# EAGLE schematic PCB_lite_v6 (EAGLE 9.7.0)
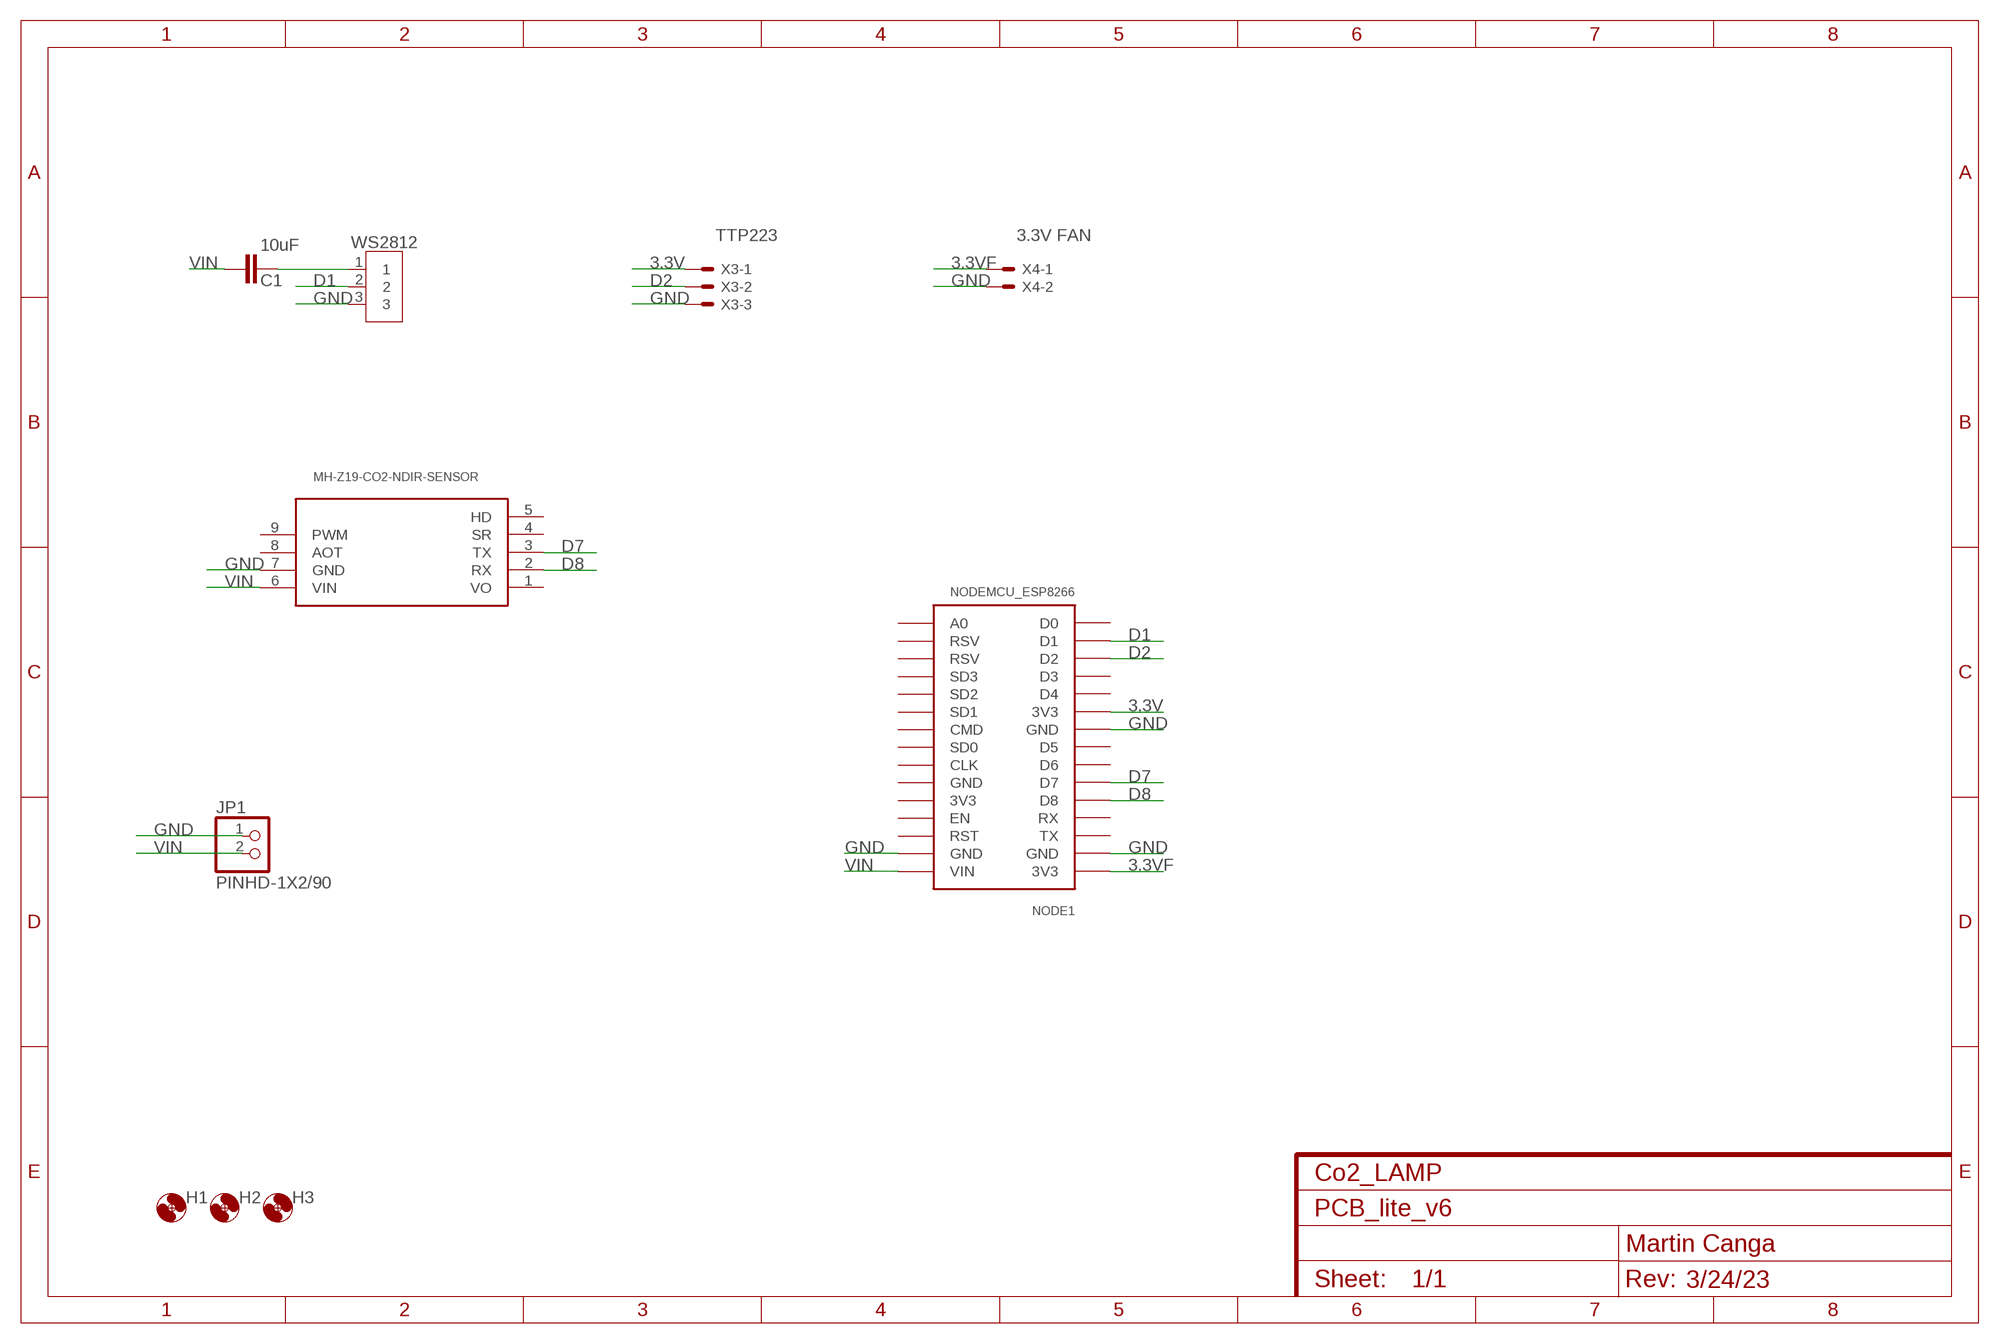
[diagram p0: schematic, sheet 1]
FRAME1 (FRAME-A4L): CNAME: Co2_LAMP; CREVISION: 3/24/23; DESIGNER: Martin Canga

## Parts
C1  10uF  C_CHIP-1210(3225-METRIC)  [CAPC3225X135]
H1  MOUNT-HOLE3.0  [3,0]
H2  MOUNT-HOLE3.0  [3,0]
H3  MOUNT-HOLE3.0  [3,0]
J1  MH-Z19-CO2-NDIR-SENSOR  [MH-Z19]
JP1  PINHD-1X2/90  [1X02/90]
NODE1  NODEMCU_ESP8266  [NODEMCU_ESP8266]
WS2812  2828XX-3282837-3  [TERMBLK_508-3N]
X3  TTP223  JST-XH-03-PIN-ROUND-PAD  [JST-XH-03-PACKAGE-ROUND-PAD]
X4  3.3V FAN  JST-XH-02-PIN-ROUND-PAD  [JST-XH-02-PACKAGE-ROUND-PAD]

## Nets
3.3V: NODE1.3V3@2(3V3) X3.1
3.3VF: NODE1.3V3@1(3V3) X4.1
D1: NODE1.D1 WS2812.2
D2: NODE1.D2 X3.2
D7: J1.3(TX) NODE1.D7
D8: J1.2(RX) NODE1.D8
GND: J1.7(GND) JP1.1 NODE1.GND@1(GND) NODE1.GND@2(GND) NODE1.GND@4(GND) WS2812.3 X3.3 X4.2
N$7: C1.2 WS2812.1
VIN: C1.1 J1.6(VIN) JP1.2 NODE1.VIN
Unconnected: J1.4(SR) J1.5(HD) J1.8(AOT) J1.9(PWM) NODE1.A0 NODE1.CLK NODE1.CMD NODE1.D0 NODE1.D3 NODE1.D4 NODE1.D5 NODE1.D6 NODE1.EN NODE1.RST NODE1.RSV1(RSV) NODE1.RSV2(RSV) NODE1.RX NODE1.SD1 NODE1.SD2 NODE1.SD3 NODE1.SDO(SD0) NODE1.TX

## Power pins joined to a net without a drawn wire
3V3: NODE1.3V3@3(3V3)
GND: NODE1.GND@3(GND)
VO: J1.1(VO)

## Library data of the parts
C1 = Capacitor:C: Capacitor - Generic; CATEGORY: Capacitor
H1-H3 = holes:MOUNT-HOLE: MOUNTING HOLE with drill center marker
J1 = mh-z19:MH-Z19: MH-Z19 - CO2 NDIR SENSOR
JP1 = Connector:PINHD-1X2: PIN HEADER; CATEGORY: CONNECTOR; SUB-CATEGORY: PIN-HEADER
NODE1 = nodemcu_esp8266 (no holes):NODEMCU_ESP8266: Node MCU V2 (ESP8266) Created by Harish
WS2812 = Connector:2828XX-3: 3 Position Wire to Board Terminal Block Horizontal with Board Datasheet <https://www.te.com.cn/commerce/DocumentDelivery/DDEController?Action=showdoc&DocId=Catalog+Section%7F1308389_EUROSTYLE_TERMINAL_BLOCKS%7F0607%7Fpdf%7FEnglish%7FENG_CS_1308389_EUROSTYLE_TERMINAL_BLOCKS_0607.pdf%7F2-282837-5>; CATEGORY: Connector; DESCRIPTION: TERM BLK 3P SIDE ENT 5.08mm PCB; MANUFACTURER: TE Connectivity; MPN: 282837-3; OPERATING_TEMPERATURE: -40°C to +105°C; PART_STATUS: Active; ROHS_COMPLIANCE: RoHS Compliant; SERIES: 282837; SUBCATEGORY: Terminal Block; TYPE: Side Wire Entry
X3 = Rembrandt Electronics - JST XH Connectors v1-0:JST-XH-03-PIN: JST XH Connector 2 Pin Wire to board connector. Pitch: 2,54 mm, (0.100") Number of pins: 3 Created by Rembrandt Electronics www.rembrandtelectronics.com
X4 = Rembrandt Electronics - JST XH Connectors v1-0:JST-XH-02-PIN: JST XH Connector 2 Pin Wire to board connector. Pitch: 2,54 mm, (0.100") Number of pins: 2 Created by Rembrandt Electronics www.rembrandtelectronics.com